# Altium project diploma_work.PrjPcb
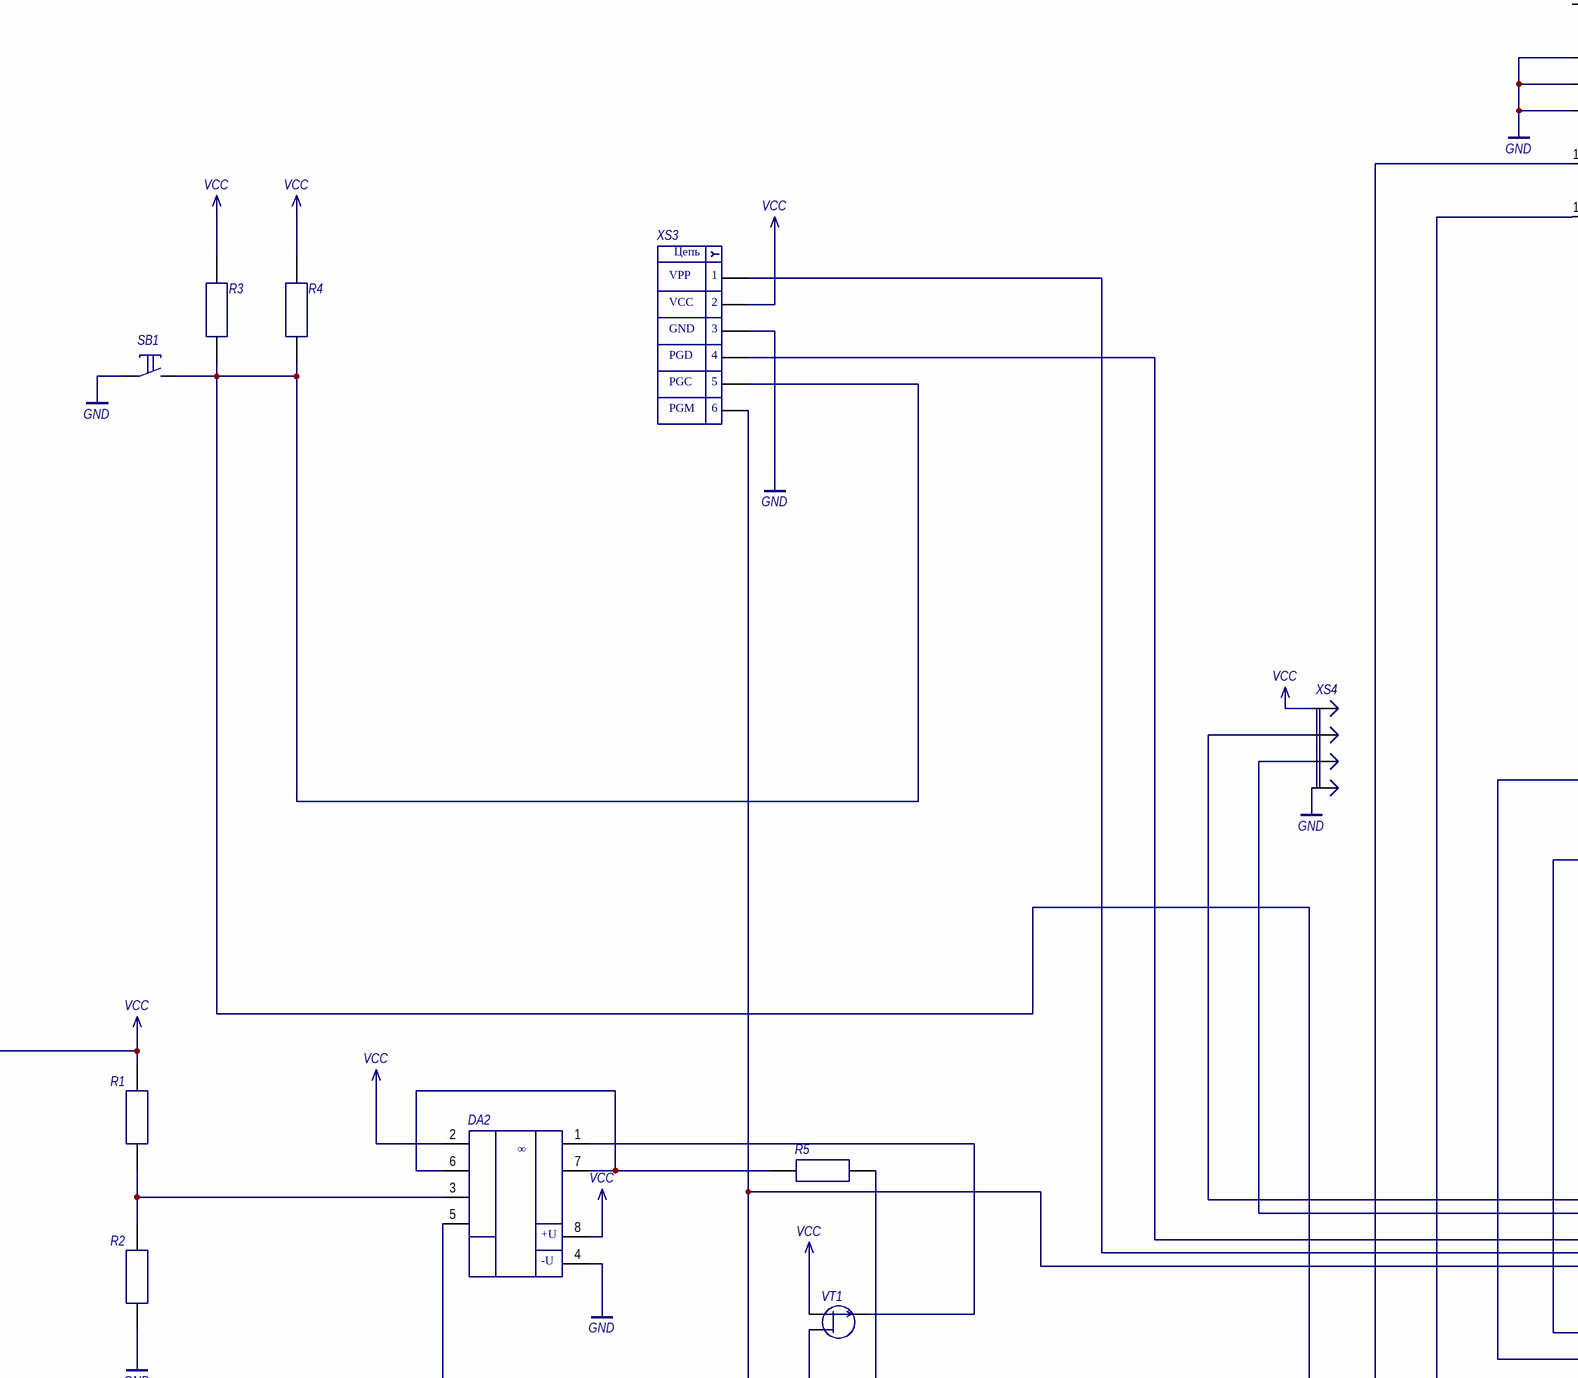
[diagram p0: Sheet1.SchDoc, top left]
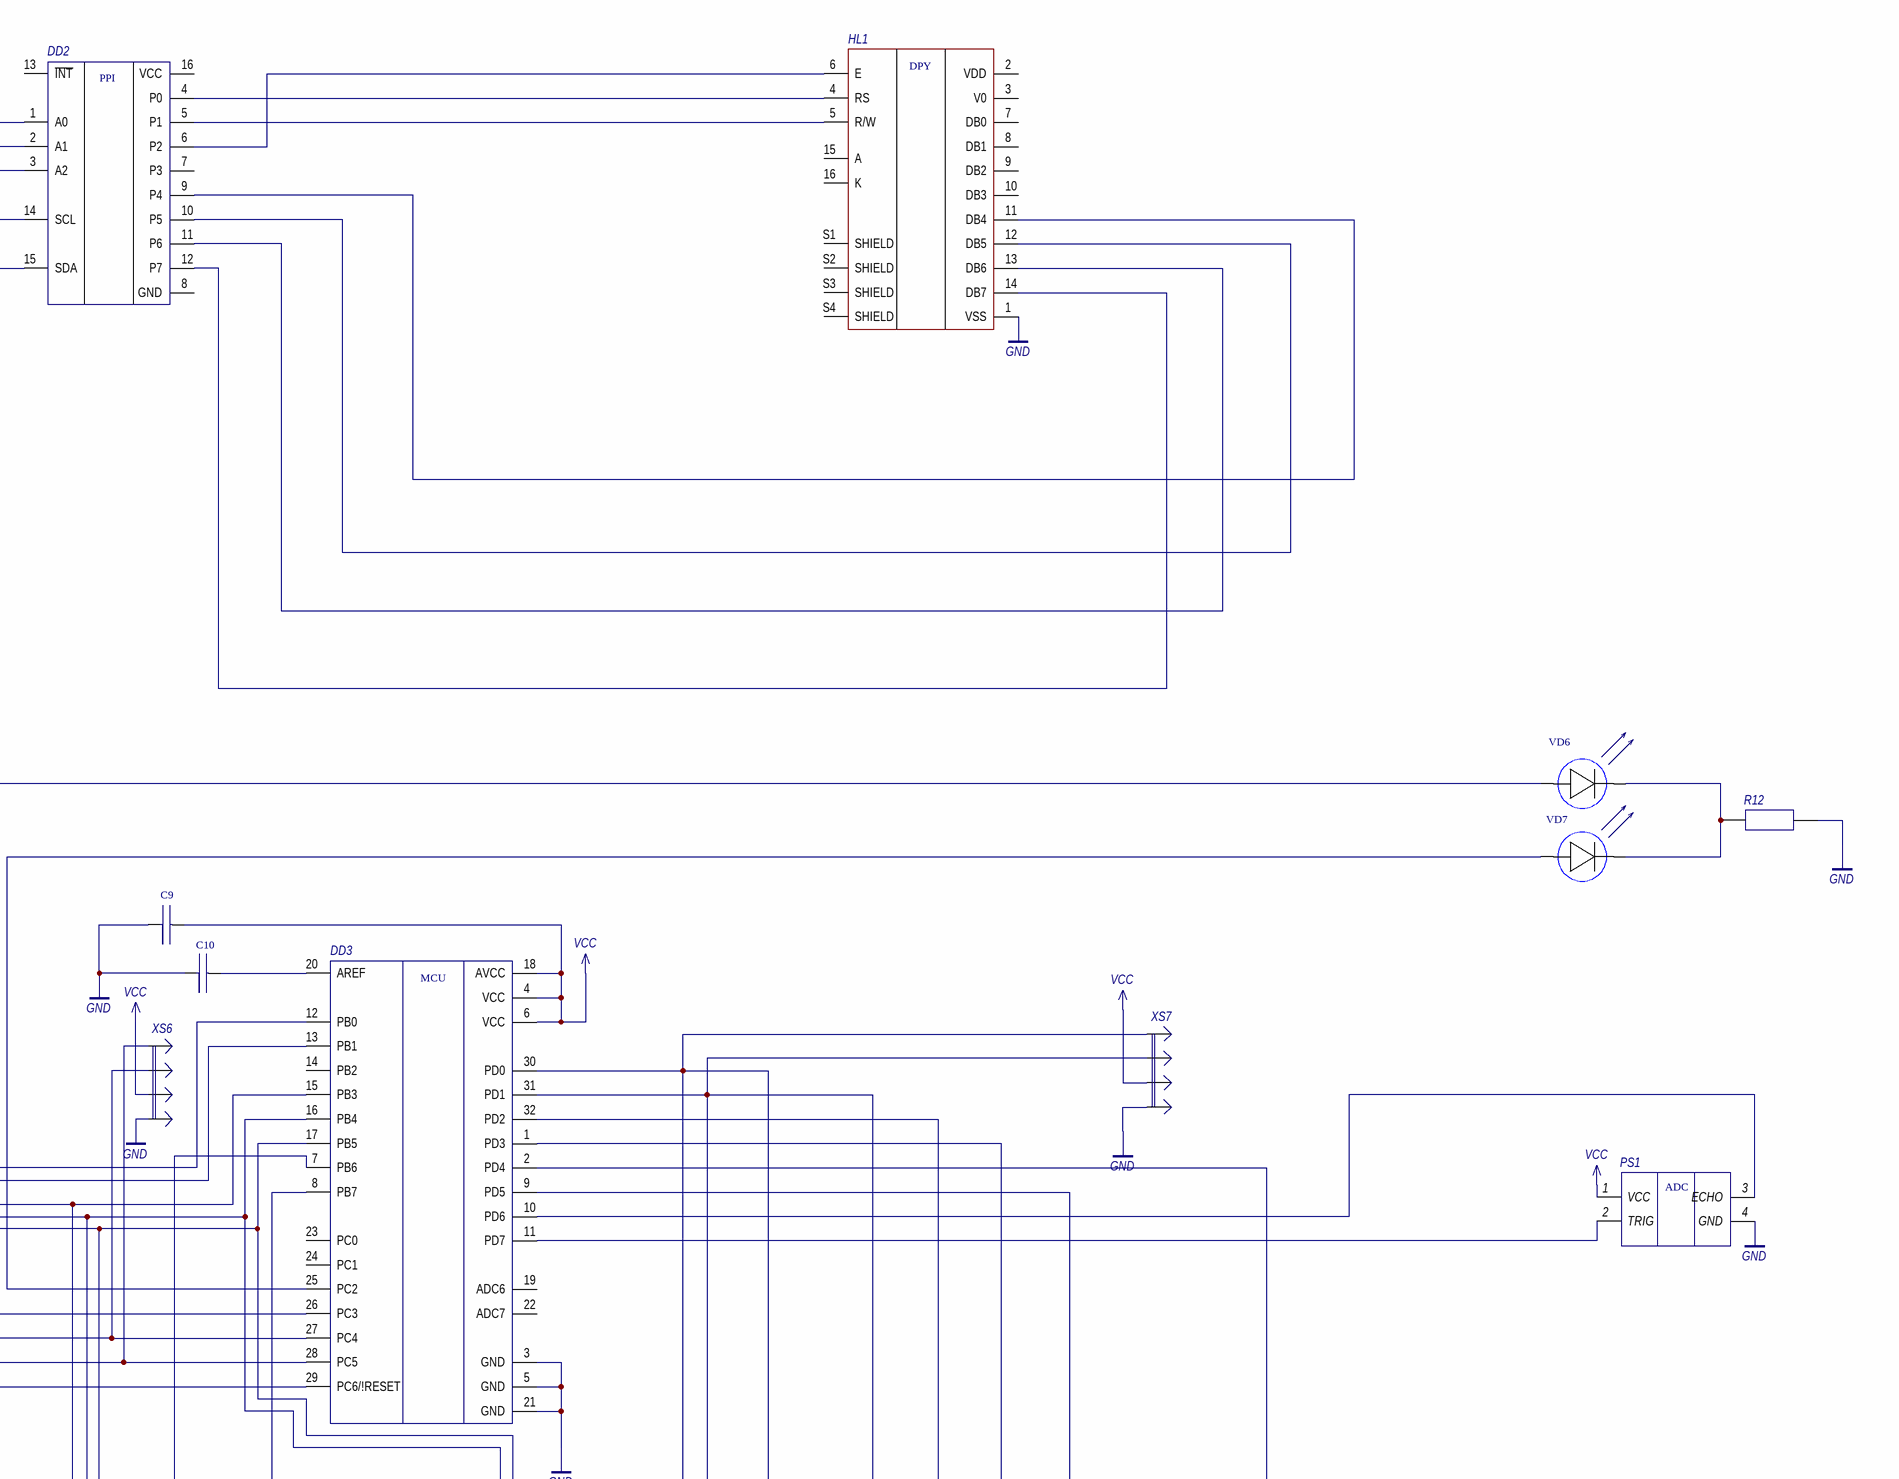
[diagram p1: Sheet1.SchDoc, top right]
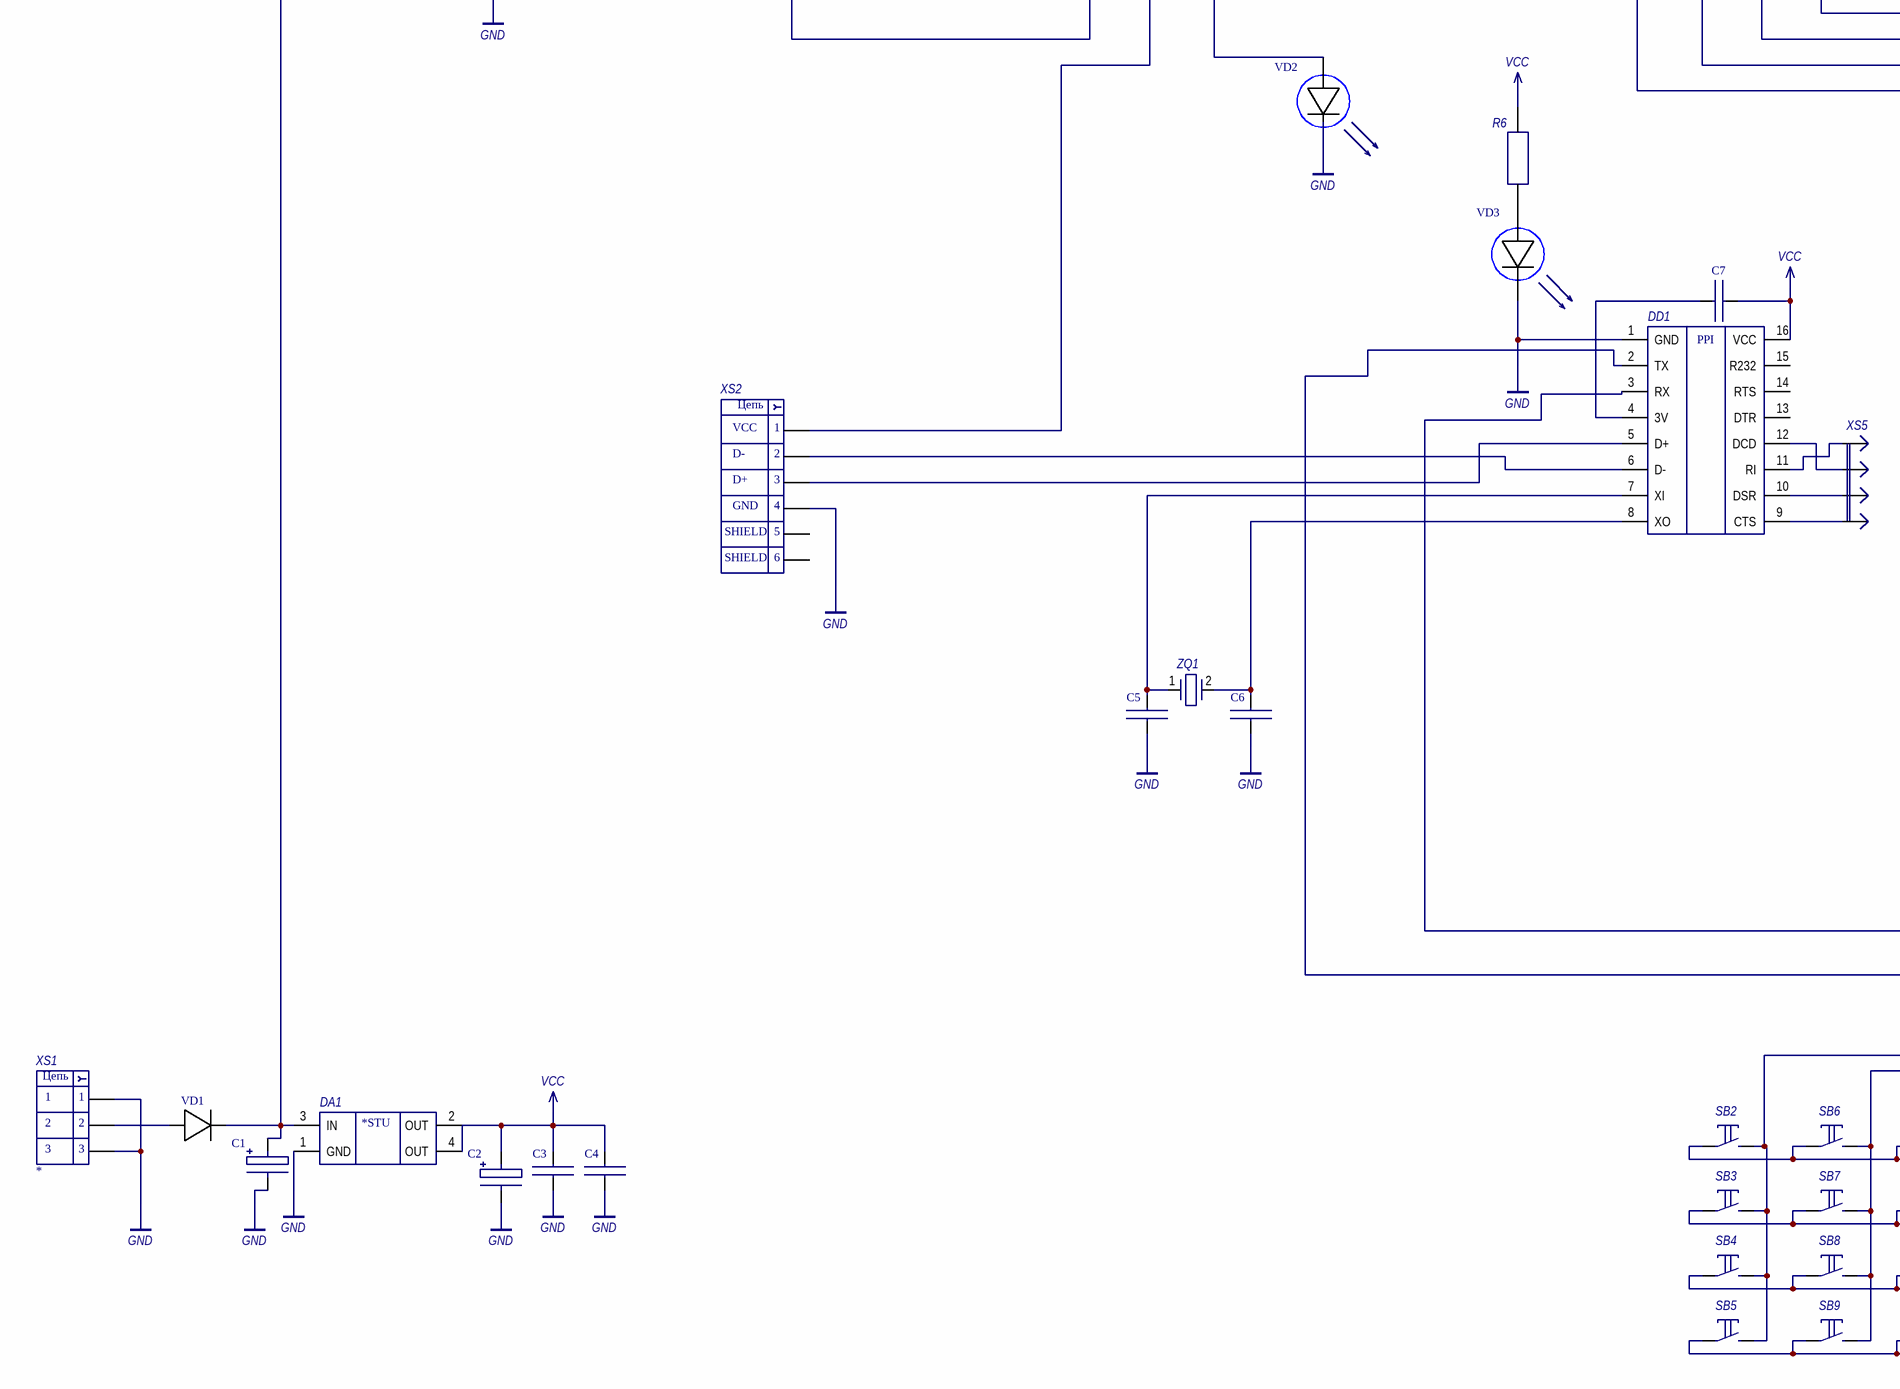
[diagram p2: Sheet1.SchDoc, bottom left]
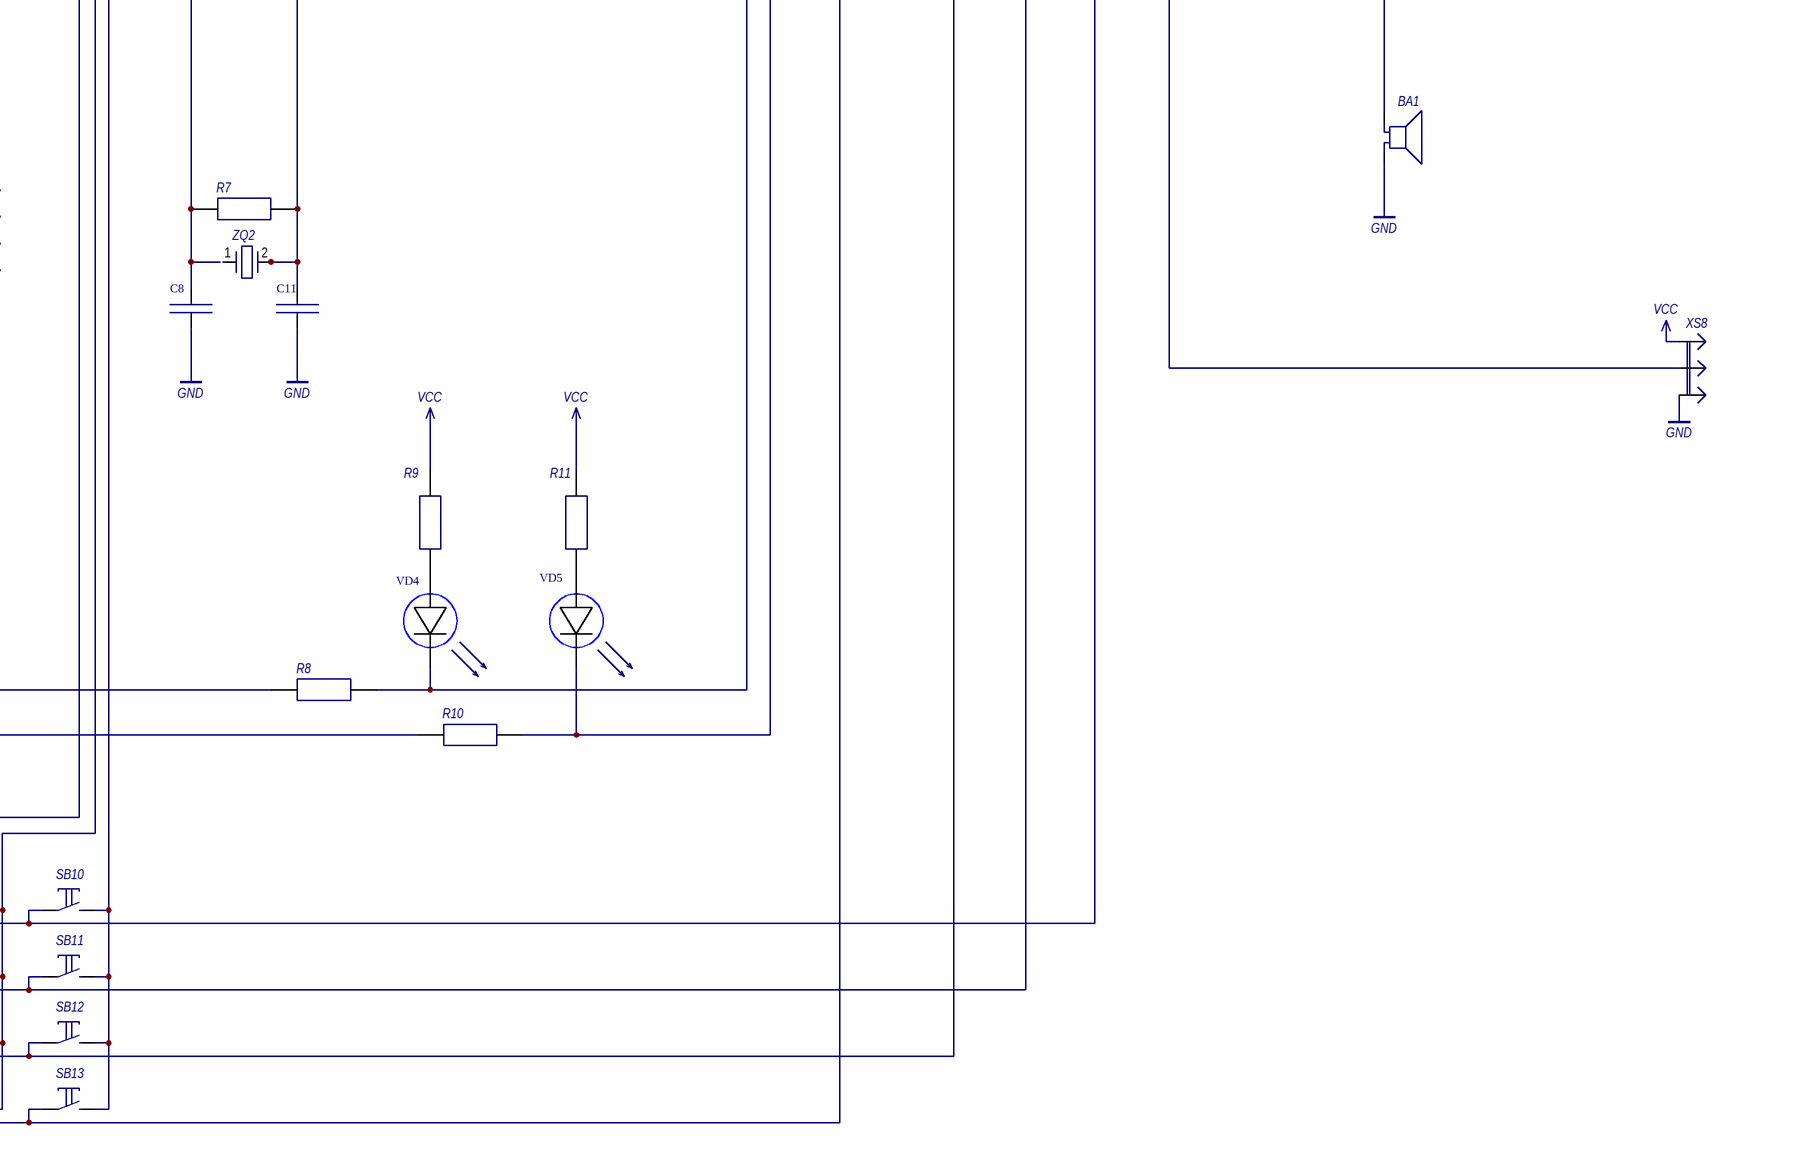
[diagram p3: Sheet1.SchDoc, bottom right]
Децимальный номер печатного узла: ГУИР 425723.001 Э3; Компания: ЭВС, гр. 750701; Наименование1: Система управления кодовым замком; Наименование2: со сканером отпечатка пальца; Начальник отдела ( альтернативное название параметра): Реценз.; Нормоконтроль: Лихачев; Обозначение: ГУИР 425723.001 Э3; Папка для сохранения графической документации: Документация; Папка для сохранения текстовой документации: Документация; Проверил: Смирнова; Разработал: Шостко; Технолог: Смирнова; Утвердил: Азаров
1 sheet, 62 parts. Net scope: global (net labels, ports and power ports of the same name join across sheets).
Board file: PCB1.PcbDoc

## Sheet Sheet1.SchDoc
size 840 x 594 mm

### Parts
BA1  *  [CUI_CVS-3108]  (value not drawn)
C1  UPM1C152MHD  [SMA/DO-214AC_DTC]  (value not drawn)
C2  UPM1C152MHD  [SMA/DO-214AC_DTC]  (value not drawn)
C3  1808Y5K00101JXT  [CAPC4520X200N]  (value not drawn)
C4  1808Y5K00101JXT  [CAPC4520X200N]  (value not drawn)
C5  1808Y5K00101JXT  [CAPC4520X200N]  (value not drawn)
C6  1808Y5K00101JXT  [CAPC4520X200N]  (value not drawn)
C7  1808Y5K00101JXT  [CAPC4520X200N]  (value not drawn)
C8  1808Y5K00101JXT  [CAPC4520X200N]  (value not drawn)
C9  1808Y5K00101JXT  [CAPC4520X200N]  (value not drawn)
C10  1808Y5K00101JXT  [CAPC4520X200N]  (value not drawn)
C11  1808Y5K00101JXT  [CAPC4520X200N]  (value not drawn)
DA1  *  [SOT230P700X180-4N]  (value not drawn)
DA2  *  [SOIC127P599X175-8N]  (value not drawn)
DD1  *  [SOIC127P1030X265-16N]  (value not drawn)
DD2  *  [DIP794W45P254L1969H508Q16]  (value not drawn)
DD3  *  [QFP80P900X900X120-32N]  (value not drawn)
HL1  *  [LCD_LCD-20X4B]  (value not drawn)
PS1  *  [XCVR_HC-SR04]  (value not drawn)
R1  *  [CAPC4520X200N]  (value not drawn)
R2  *  [CAPC4520X200N]  (value not drawn)
R3  *  [CAPC4520X200N]  (value not drawn)
R4  *  [CAPC4520X200N]  (value not drawn)
R5  *  [CAPC4520X200N]  (value not drawn)
R6  *  [CAPC4520X200N]  (value not drawn)
R7  *  [CAPC4520X200N]  (value not drawn)
R8  *  [CAPC4520X200N]  (value not drawn)
R9  *  [CAPC4520X200N]  (value not drawn)
R10  *  [CAPC4520X200N]  (value not drawn)
R11  *  [CAPC4520X200N]  (value not drawn)
R12  *  [CAPC4520X200N]  (value not drawn)
SB1  4-1437565-9  [TE_4-1437565-9]  (value not drawn)
SB2  4-1437565-9  [TE_4-1437565-9]  (value not drawn)
SB3  4-1437565-9  [TE_4-1437565-9]  (value not drawn)
SB4  4-1437565-9  [TE_4-1437565-9]  (value not drawn)
SB5  4-1437565-9  [TE_4-1437565-9]  (value not drawn)
SB6  4-1437565-9  [TE_4-1437565-9]  (value not drawn)
SB7  4-1437565-9  [TE_4-1437565-9]  (value not drawn)
SB8  4-1437565-9  [TE_4-1437565-9]  (value not drawn)
SB9  4-1437565-9  [TE_4-1437565-9]  (value not drawn)
SB10  4-1437565-9  [TE_4-1437565-9]  (value not drawn)
SB11  4-1437565-9  [TE_4-1437565-9]  (value not drawn)
SB12  4-1437565-9  [TE_4-1437565-9]  (value not drawn)
SB13  4-1437565-9  [TE_4-1437565-9]  (value not drawn)
VD1  1N4007  [DIOAD1060W80L520D270]  (value not drawn)
VD2  CLA1A-WKW-CXAYB153  [SOJ150P350X210-4N]  (value not drawn)
VD3  CLA1A-WKW-CXAYB153  [SOJ150P350X210-4N]  (value not drawn)
VD4  CLA1A-WKW-CXAYB153  [SOJ150P350X210-4N]  (value not drawn)
VD5  CLA1A-WKW-CXAYB153  [SOJ150P350X210-4N]  (value not drawn)
VD6  CLA1A-WKW-CXAYB153  [SOJ150P350X210-4N]  (value not drawn)
VD7  CLA1A-WKW-CXAYB153  [SOJ150P350X210-4N]  (value not drawn)
VT1  *  [SOT95P237X112-3N]  (value not drawn)
XS1  *  [CUI_PJ-038B]
XS2  *  [SAMTEC_USB-B-S-X-X-TH]  (value not drawn)
XS3  *  [MOLEX-1X6]  (value not drawn)
XS4  *  [SAMTEC_TW-02-03-T-D-335-100]  (value not drawn)
XS5  *  [SAMTEC_TW-02-03-T-D-335-100]  (value not drawn)
XS6  *  [SAMTEC_TW-02-03-T-D-335-100]  (value not drawn)
XS7  *  [SAMTEC_TW-02-03-T-D-335-100]  (value not drawn)
XS8  *  [SAMTEC_TW-03-12-L-S-765-200]  (value not drawn)
ZQ1  *  [XTAL500X320X130N]  (value not drawn)
ZQ2  *  [XTAL500X320X130N]  (value not drawn)

### Nets
GND: BA1.N C1.N C2.N C3.1 C4.1 C5.1 C6.1 C8.1 C9.1 C10.1 C11.1 DA1.1(GND) DA2.4(V-) DD1.1(GND) DD2.1(A0) DD2.2(A1) DD2.3(A2) DD3.3(GND) DD3.5(GND) DD3.21(GND) HL1.1(VSS) PS1.4(GND) R2.1 R12.2 SB1.1 VD2.4(C) VD3.4(C) XS1.1 XS1.3 XS2.4(GND) XS3.4(GND) XS4.04 XS6.04 XS7.04 XS8.03
VCC: C1.P C2.P C3.2 C4.2 C7.1 C9.2 DA1.2(OUT) DA1.3(IN) DA1.4(OUT) DA2.2(IN1-) DA2.8(V+) DD1.16(VCC) DD3.4(VCC) DD3.6(VCC) DD3.18(AVCC) PS1.1(VCC) R1.2 R3.2 R4.2 R6.2 R9.2 R11.2 VD1.C VT1.2(S) XS3.5(VCC) XS4.01 XS6.03 XS7.03 XS8.01
NetBA1_P: BA1.P DD3.2(PD4)
NetC5_2: C5.2 DD1.7(XI) ZQ1.1
NetC6_2: C6.2 DD1.8(XO) ZQ1.2
NetC7_2: C7.2 DD1.4(3V)
NetC8_2: C8.2 DD3.7(PB6) R7.2
NetC10_2: C10.2 DD3.20(AREF)
NetC11_2: C11.2 DD3.8(PB7) R7.1 ZQ2.2
NetDA2_1: DA2.1(OUT1) VT1.1(G)
NetDA2_3: DA2.3(IN1+) R1.1 R2.2
NetDA2_5: DA2.5(IN2+) DD3.17(PB5) DD3.30(PD0) R8.2 SB5.1 SB9.1 SB10.3 SB11.3 SB12.3 SB13.1 SB13.3 VD4.4(C) XS3.1(PGM) XS7.01
NetDA2_6: DA2.6(IN2-) DA2.7(OUT2) R5.1
NetDD1_2: DD1.2(TX) R10.1
NetDD1_3: DD1.3(RX) R8.1
NetDD1_5: DD1.5(D+) XS2.3(D+)
NetDD1_6: DD1.6(D-) XS2.2(D-)
NetDD1_9: DD1.9(CTS) XS5.04
NetDD1_10: DD1.10(DSR) XS5.03
NetDD1_11: DD1.11(RI) XS5.01
NetDD1_12: DD1.12(DCD) XS5.02
NetDD2_4: DD2.4(P0) HL1.4(RS)
NetDD2_5: DD2.5(P1) HL1.5(R/W)
NetDD2_6: DD2.6(P2) HL1.6(E)
NetDD2_9: DD2.9(P4) HL1.11(DB4)
NetDD2_10: DD2.10(P5) HL1.12(DB5)
NetDD2_11: DD2.11(P6) HL1.13(DB6)
NetDD2_12: DD2.12(P7) HL1.14(DB7)
NetDD2_14: DD2.14(SCL) DD3.28(PC5) XS6.01
NetDD2_15: DD2.15(SDA) DD3.27(PC4) XS6.02
NetDD3_1: DD3.1(PD3) SB2.1 SB6.1 SB10.1
NetDD3_9: DD3.9(PD5) XS8.02
NetDD3_10: DD3.10(PD6) PS1.3(ECHO)
NetDD3_11: DD3.11(PD7) PS1.2(TRIG)
NetDD3_12: DD3.12(PB0) XS4.02
NetDD3_13: DD3.13(PB1) XS4.03
NetDD3_15: DD3.15(PB3) SB2.3 SB3.3 SB4.3 SB5.3 XS3.3(PGD)
NetDD3_16: DD3.16(PB4) DD3.31(PD1) R10.2 SB4.1 SB6.3 SB7.3 SB8.1 SB8.3 SB9.3 SB12.1 VD5.4(C) XS3.6(VPP) XS7.02
NetDD3_25: DD3.25(PC2) VD7.2(A)
NetDD3_26: DD3.26(PC3) VD6.2(A)
NetDD3_29: DD3.29(PC6/!RESET) R3.1 R4.1 SB1.3 XS3.2(PGC)
NetDD3_32: DD3.32(PD2) SB3.1 SB7.1 SB11.1
NetR5_2: R5.2 VD2.2(A)
NetR6_1: R6.1 VD3.2(A)
NetR9_1: R9.1 VD4.2(A)
NetR11_1: R11.1 VD5.2(A)
NetR12_1: R12.1 VD6.4(C) VD7.4(C)
NetVD1_A: VD1.A XS1.2
NetVT1_3: VT1.3(D) XS2.1(VCC)

Not connected (* = marked no-connect by the designer): DD1 13(DTR) 14(RTS) 15(R232); DD2 7(P3) 8(GND) 13(~{INT}) 16(VCC); DD3 14(PB2) 19(ADC6) 22(ADC7) 23(PC0) 24(PC1); HL1 2(VDD) 3(V0) 7(DB0) 8(DB1) 9(DB2) 10(DB3) 15(A) 16(K) S1(SHIELD) S2(SHIELD) S3(SHIELD) S4(SHIELD); SB1 2 4; SB2 2 4; SB3 2 4; SB4 2 4; SB5 2 4; SB6 2 4; SB7 2 4; SB8 2 4; SB9 2 4; SB10 2 4; SB11 2 4; SB12 2 4; SB13 2 4; XS2 S1(SHIELD) S2(SHIELD); ZQ2 1

### Notes on the sheet
- Перв. примен.
- Справ. №
- Подп. и дата
- Инв. № дубл.
- Взам. инв. №
- Разраб.
- Изм.
- Лист
- № докум.
- Подп.
- Дата
- Лит.
- Масса
- Масштаб
- Пров.
- Т. контр.
- Листов
- Инв. № подл.
- Н. контр.
- Утв.
- Копировал
- Формат А1
- (in symbol ATMEGA328P-AU) MCU
- (in symbol CH340) PPI
- (in symbol HC-SR04) ADC
- (in symbol LCD-20X4B) DPY
- (in symbol LM358D) ∞; +U; -U
- (in symbol NCP1117ST50T3G) *STU
- (in symbol PCF8574N) PPI
- (in symbol PIC-ICSP) Цепь
- (in symbol PJ-038B) Цепь
- (in symbol USB-B-S-X-X-TH) Цепь; 5; 6

### Library data of the parts
BA1 = CVS-3108: 31.8 mm, Round Frame, 0.1 W, 8 Ohm, Neodymium Magnet, Mylar Cone, Speaker; MF: CUI Devices; Value: *; Package: CUI Inc.; DigiKey-Purchase-URL: https://snapeda.com/shop?store=DigiKey&id=1474279; Arrow_Electronics-Purchase-URL: https://snapeda.com/shop?store=Arrow+Electronics&id=1474279; MP: CVS-3108; CUI_purchase_URL: https://www.cuidevices.com/product/audio/speakers/miniature-(10-mm~40-mm)/cvs-3108?utm_source=snapeda.com&utm_medium=referral&utm_campaign=snapedaBOM; Availability: Good; Price: None; SnapEDA_Link: https://www.snapeda.com/parts/CVS-3108/CUI%20Devices/view-part/1474279/?ref=snap; Mouser-Purchase-URL: https://snapeda.com/shop?store=Mouser&id=1474279
C1 C2 = UPM1C152MHD: 1500ÂµF 16V Aluminum Electrolytic Capacitors Radial, Can 5000 Hrs @ 105Â°C; MF: Nichicon; Price: None; MP: UPM1C152MHD; SnapEDA_Link: https://www.snapeda.com/parts/UPM1C152MHD/Nichicon/view-part/2322603/?ref=snap; Purchase-URL: https://pricing.snapeda.com/search/part/UPM1C152MHD/?ref=eda; Package: Radial Nichicon; Value: *; Availability: Warning; Check_prices: https://www.snapeda.com/parts/UPM1C152MHD/Nichicon/view-part/2322603/?ref=eda
DA1 = NCP1117ST50T3G: Linear Voltage Regulator IC 1 Output 1A SOT-223; MF: ON Semiconductor; MP: NCP1117ST50T3G; Package: TO-261-4 ON Semiconductor; Price: None; Value: *; SnapEDA_Link: https://www.snapeda.com/parts/NCP1117ST50T3G/ON%20Semiconductor/view-part/836318/?ref=snap; Availability: Unavailable
DA2 = LM358D: Dual standard operational amplifier 8-SOIC 0 to 70; MF: Texas Instruments; Digi-Key_Part_Number: 296-1014-2-ND; Arrow_Electronics-Purchase-URL: https://snapeda.com/shop?store=Arrow+Electronics&id=4793021; MP: LM358D; Value: *; SnapEDA_Link: https://www.snapeda.com/parts/LM358D/Texas%20Instruments/view-part/4793021/?ref=snap; DigiKey-Purchase-URL: https://snapeda.com/shop?store=DigiKey&id=4793021; Package: SOIC-8 Texas Instruments; Texas_Instruments-Purchase-URL: https://snapeda.com/shop?store=Texas+Instruments&id=4793021; Mouser-Purchase-URL: https://snapeda.com/shop?store=Mouser&id=4793021; Arrow_Asia-Purchase-URL: https://snapeda.com/shop?store=Arrow+Asia&id=4793021
DD1 = CH340: Circuit Breaker Magnetic 3Pole 40A 240VAC; MF: Eaton; Availability: Unavailable; Price: None; Package: None; Value: *; SnapEDA_Link: https://www.snapeda.com/parts/CH340/Eaton/view-part/4701946/?ref=snap; MP: CH340
DD2 = PCF8574N: Remote 8-Bit I/O Expander for I2C-Bus; MF: Texas Instruments; DigiKey-Purchase-URL: https://snapeda.com/shop?store=DigiKey&id=271889; Mouser-Purchase-URL: https://snapeda.com/shop?store=Mouser&id=271889; Value: *; MP: PCF8574N; Availability: Unavailable; Price: None; Arrow_Electronics-Purchase-URL: https://snapeda.com/shop?store=Arrow+Electronics&id=271889; Texas_Instruments-Purchase-URL: https://snapeda.com/shop?store=Texas+Instruments&id=271889; Package: PDIP-16 Texas Instruments; SnapEDA_Link: https://www.snapeda.com/parts/PCF8574N/Texas%20Instruments/view-part/271889/?ref=snap
DD3 = ATMEGA328P-AU: AVR AVRÂ® ATmega Microcontroller IC 8-Bit 20MHz 32KB _16K x 16_ FLASH 32-TQFP _7x7_; MF: Microchip; Value: *; SnapEDA_Link: https://www.snapeda.com/parts/ATMEGA328P-AU/Microchip/view-part/44280/?ref=snap; MP: ATMEGA328P-AU; Availability: Unavailable; Price: None; Package: TQFP-32 Microchip
HL1 = LCD-20X4B: Display Development Tools 20X4 CHARACTER BLUE LCD W/BACKLIGHT; MF: Gravitech; Price: None; Value: *; Availability: Unavailable; Mouser-Purchase-URL: https://snapeda.com/shop?store=Mouser&id=833821; SnapEDA_Link: https://www.snapeda.com/parts/LCD-20X4B/Gravitech/view-part/833821/?ref=snap; MP: LCD-20X4B; Package: None
PS1 = HC-SR04: HC-SR04 Ultrasonic Sensor Platform Evaluation Expansion Board; MF: SparkFun Electronics; Value: *; SnapEDA_Link: https://www.snapeda.com/parts/HC-SR04/SparkFun%20Electronics/view-part/341106/?ref=snap; MP: HC-SR04; Availability: Unavailable; Price: None; Package: None
R1-R12 = Component_1
SB1-SB13 = 4-1437565-9: Switch Tactile OFF _ON_ SPST Round Button Gull Wing 0.05A 12VDC 1.57N SMD Loose Piece; MF: TE Connectivity; Configuration_Pole-Throw: Single Pole - Single Throw; MP: FSM6JSMA; Contact_Current_Rating: 50 mA; Value: *; Digi-Key_Part_Number: 450-1133-ND; SnapEDA_Link: https://www.snapeda.com/parts/FSM6JSMA/TE%20Connectivity%20ALCOSWITCH%20Switches/view-part/522766/?ref=snap; TE_purchase_URL: https://www.te.com/usa-en/product-4-1437565-9.html?te_bu=Cor&te_type=disp&te_campaign=seda_glo_cor-seda-global-disp-prtnr-fy19-seda-model-bom-cta_sma-317_1&elqCampaignId=32493; Package: None; Digi-Key_Purchase_URL: https://www.digikey.com/product-detail/en/te-connectivity-alcoswitch-switches/FSM6JSMA/450-1133-ND/525822?utm_source=snapeda&utm_medium=aggregator&utm_campaign=symbol; EU_RoHS_Compliance: Compliant
VD1 = 1N4007: Diode Standard 1000V 1A Through Hole DO-204AL _DO-41_; MF: ON Semiconductor; Package: DO-41 Good-Ark; Value: *; Price: None; MP: 1N4007; Availability: Unavailable; SnapEDA_Link: https://www.snapeda.com/parts/1N4007/ON%20Semiconductor/view-part/2816213/?ref=snap
VD2-VD7 = CLA1A-WKW-CXAYB153: LED Lighting - White, Cool 5500K 3.6V 30mA 4-PLCC; MF: Cree Inc.; SnapEDA_Link: https://www.snapeda.com/parts/CLA1A-WKW-CXAYB153/Cree%20Inc./view-part/1050629/?ref=snap; Digi-Key_Purchase_URL: https://www.digikey.com/product-detail/en/cree-inc/CLA1A-WKW-CXAYB153/CLA1A-WKW-CXAYB153CT-ND/3659978?utm_source=snapeda&utm_medium=aggregator&utm_campaign=symbol; Value: *; Package: PLCC-4 Cree; MP: CLA1A-WKW-CXAYB153; Digi-Key_Part_Number: CLA1A-WKW-CXAYB153CT-ND
VT1 = IRLML6402TRPBF: RoHS Compliant | Industry-leading quality | Fast Switching | Low Profile _less than 1.1mm_ | P-Channel MOSFET | SOT-23 Footprint; MF: Infineon; Package: SOT-23 Infineon; Value: *; Price: None; MP: IRLML6402TRPBF; SnapEDA_Link: https://www.snapeda.com/parts/IRLML6402TRPBF/Infineon%20Technologies/view-part/523558/?ref=snap; Availability: Unavailable
XS1 = PJ-038B: 2.5 x 6.2 mm, 2.5 A, Horizontal, Panel Mount, Dc Power Jack Connector; MF: CUI Devices; Package: None; Price: None; Value: *; SnapEDA_Link: https://www.snapeda.com/parts/PJ-038B/CUI%20Devices/view-part/1494366/?ref=snap; MP: PJ-038B; Availability: Unavailable
XS2 = USB-B-S-X-X-TH: USB-B (USB TYPE-B) USB 2.0 Receptacle Connector 4 Position Through Hole, Right Angle; MP: USB-B-S-S-B-TH; MF: Samtec; Availability: Unavailable; Package: None; SnapEDA_Link: https://www.snapeda.com/parts/USB-B-S-S-B-TH/Samtec%20Inc./view-part/230656/?ref=snap; Value: *; Price: None; Toby_UK-Purchase-URL: https://snapeda.com/shop?store=Toby+UK&id=230656
XS3 = PIC-ICSP: MICROCHIP ICSP PROG ADAPTER SET; MF: Olimex LTD; Price: None; Value: *; MP: PIC-ICSP; Package: None; SnapEDA_Link: https://www.snapeda.com/parts/PIC-ICSP/Olimex%20LTD/view-part/53514/?ref=snap; Availability: Unavailable
XS4-XS7 = TW-02-03-T-D-335-100: 4 Position Header Spacer Connector 0.079 (2.00mm) Tin Through Hole; MF: Samtec; Value: *; SnapEDA_Link: https://www.snapeda.com/parts/TW-02-03-T-D-335-100/Samtec/view-part/3263296/?ref=snap; MP: TW-02-03-T-D-335-100; Purchase-URL: https://pricing.snapeda.com/search/part/TW-02-03-T-D-335-100/?ref=eda; Check_prices: https://www.snapeda.com/parts/TW-02-03-T-D-335-100/Samtec/view-part/3263296/?ref=eda; Availability: Bad; Price: None; Package: None
XS8 = TW-03-12-L-S-765-200: CONN BRD STACK 2.00 3POS; MF: Samtec; SnapEDA_Link: https://www.snapeda.com/parts/TW-03-12-L-S-765-200/Samtec/view-part/3584672/?ref=snap; Purchase-URL: https://pricing.snapeda.com/search/part/TW-03-12-L-S-765-200/?ref=eda; Value: *; MP: TW-03-12-L-S-765-200; Availability: Warning; Check_prices: https://www.snapeda.com/parts/TW-03-12-L-S-765-200/Samtec/view-part/3584672/?ref=eda; Package: None; Price: None
ZQ1 ZQ2 = ABM3-16.000MHZ-B4Y-T: 16MHz Â±30ppm Crystal 18pF 40 Ohms 2-SMD, No Lead; MF: Abracon; Digi-Key_Part_Number: 535-13579-1-ND; MP: ABM3-16.000MHZ-B4Y-T; Package: SMD-2 Abracon; Purchase-URL: https://pricing.snapeda.com/search/part/ABM3-16.000MHZ-B4Y-T/?ref=eda; SnapEDA_Link: https://www.snapeda.com/parts/ABM3-16.000MHZ-B4Y-T/Abracon%20LLC/view-part/552784/?ref=snap; Value: *; Check_prices: https://www.snapeda.com/parts/ABM3-16.000MHZ-B4Y-T/Abracon%20LLC/view-part/552784/?ref=eda
C3-C11 = 1808Y5K00101JXT: Package: None; Price: None; Value: *; MP: 1808Y5K00101JXT; Availability: Unavailable